# EAGLE design LPC1115_4TE_TOP (EAGLE 9.6.2)
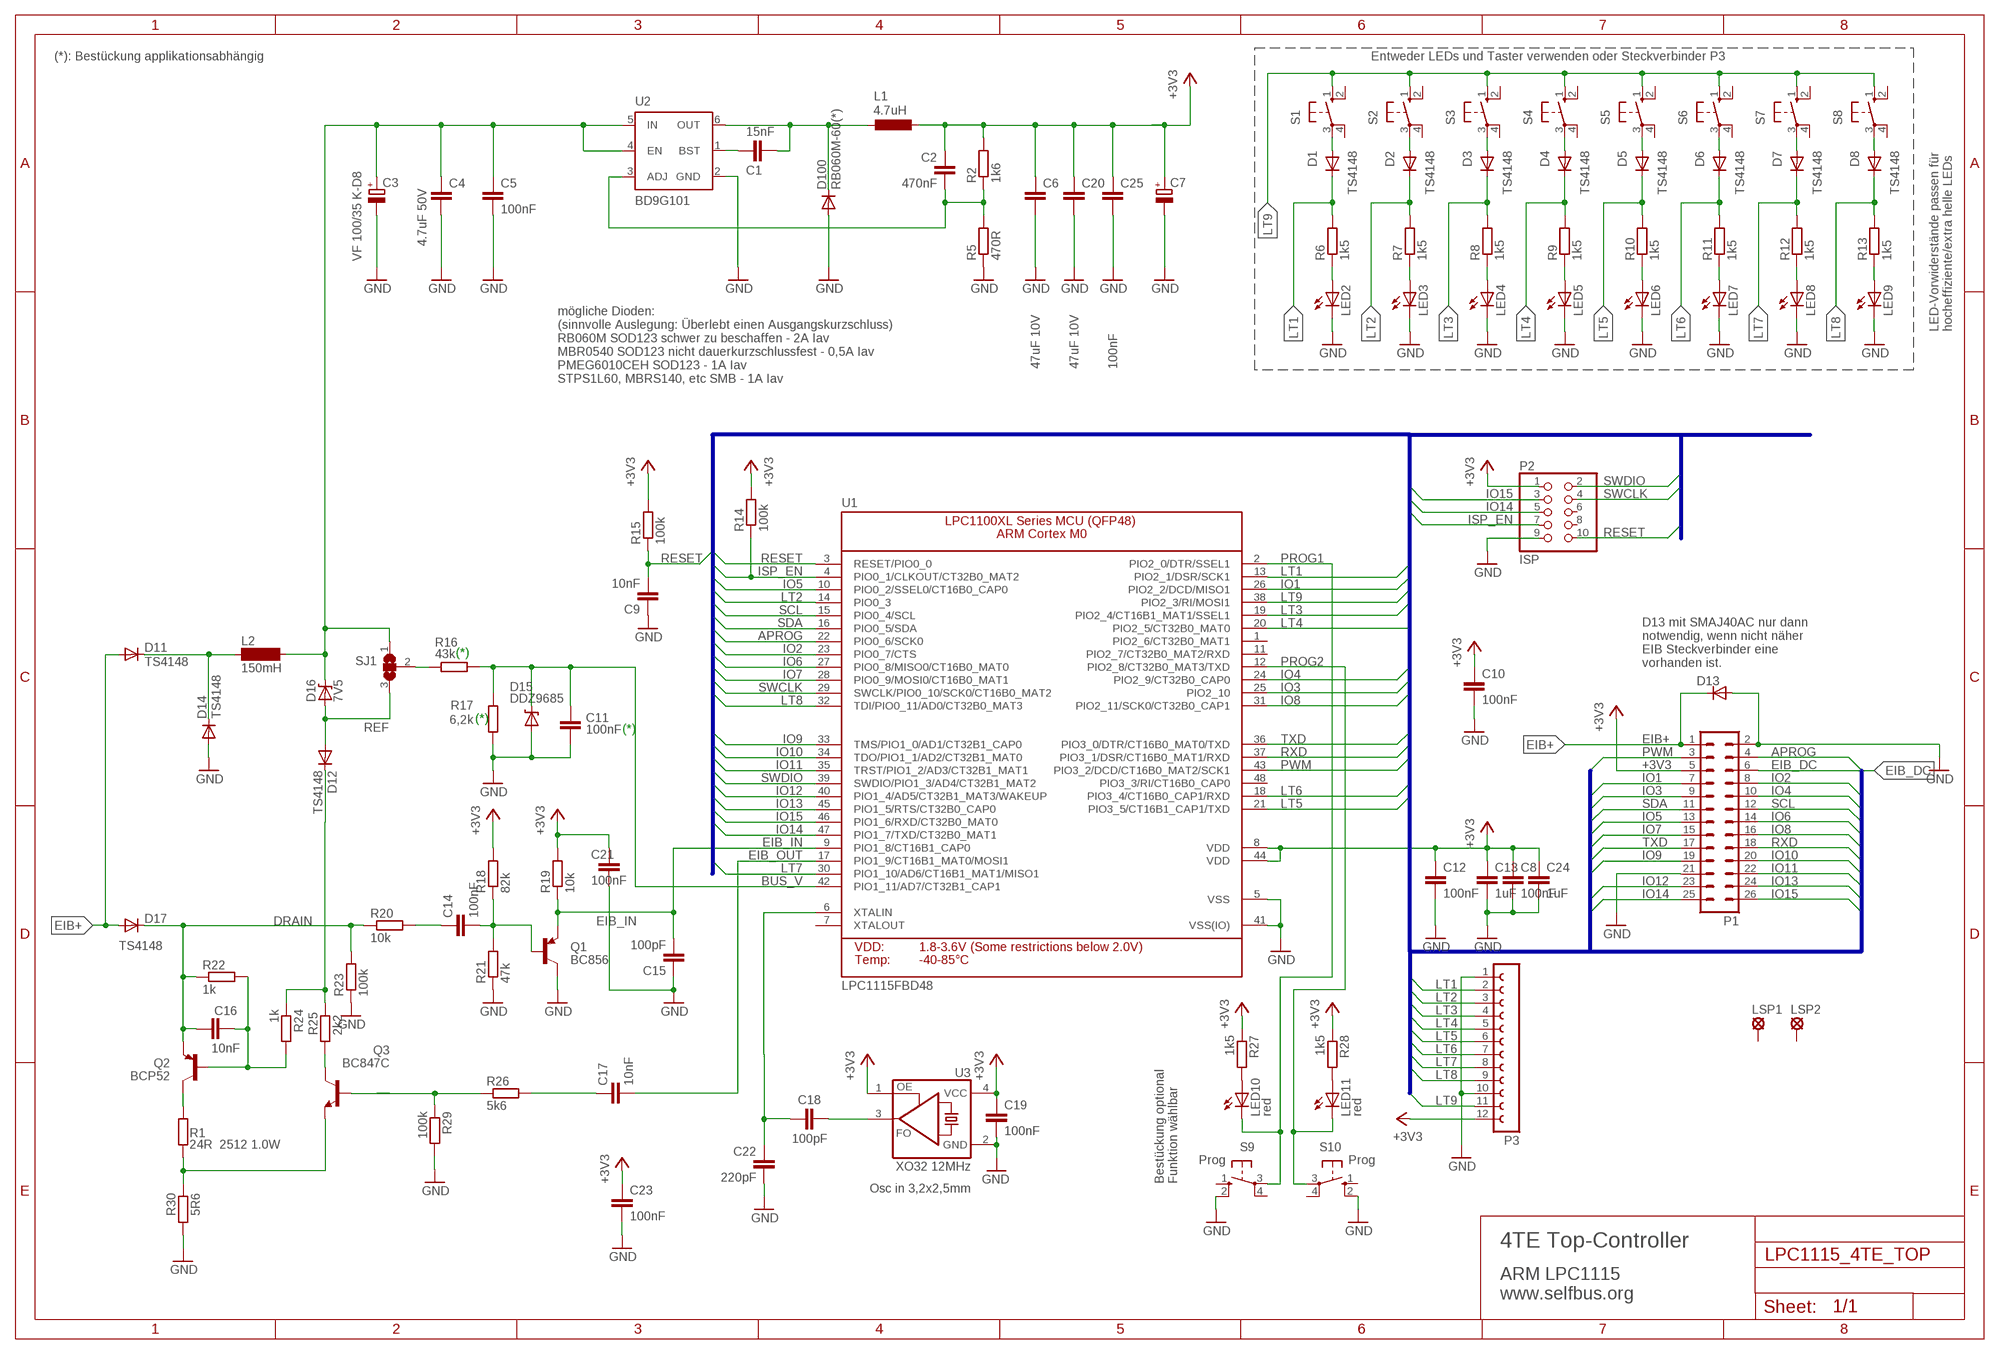
[diagram p0: schematic, sheet 1]

## Parts
C1  15nF  C-EUC0805  [C0805]
C2  470nF  C-EUC0805  [C0805]
C3  VF 100/35 K-D8  CPOL-EUESMD-D  [ESMD-D]
C4  4.7uF 50V  C-EUC0805  [C0805]
C5  100nF  C-EUC0805  [C0805]
C6  47uF 10V  C-EUC0805  [C0805]
C7  100uF  CPOL-EUESMD-D  [ESMD-D]
C8  100nF  C-EUC0805  [C0805]
C9  10nF  C-EUC0805  [C0805]
C10  100nF  C-EUC0805  [C0805]
C11  100nF  C-EUC0805  [C0805]
C12  100nF  C-EUC0805  [C0805]
C13  1uF  C-EUC0805  [C0805]
C14  100nF  C-EUC0805  [C0805]
C15  100pF  C-EUC0805  [C0805]
C16  10nF  C-EUC0805  [C0805]
C17  10nF  C-EUC0805  [C0805]
C18  100pF  C-EUC0805  [C0805]
C19  100nF  C-EUC0805  [C0805]
C20  47uF 10V  C-EUC0805  [C0805]
C21  100nF  C-EUC0805  [C0805]
C22  220pF  C-EUC0805  [C0805]
C23  100nF  C-EUC0805  [C0805]
C24  1uF  C-EUC0805  [C0805]
C25  100nF  C-EUC1206  [C1206]
D1  TS4148  DIODE-D0805  [D0805]
D2  TS4148  DIODE-D0805  [D0805]
D3  TS4148  DIODE-D0805  [D0805]
D4  TS4148  DIODE-D0805  [D0805]
D5  TS4148  DIODE-D0805  [D0805]
D6  TS4148  DIODE-D0805  [D0805]
D7  TS4148  DIODE-D0805  [D0805]
D8  TS4148  DIODE-D0805  [D0805]
D11  TS4148  DIODE-D0805  [D0805]
D12  TS4148  DIODE-D0805  [D0805]
D13  SMAJ40AC  D-SMB  [SMB]
D14  TS4148  DIODE-D0805  [D0805]
D15  DDZ9685  DIODE-ZENERSOD-123  [SOD-123]
D16  7V5  DIODE-ZENERSOD-123  [SOD-123]
D17  TS4148  DIODE-D0805  [D0805]
D100  RB060M-60(*)  DIODE-SOD123  [SOD123]
L1  4.7uH  L-EUL4532P  [L4532P]
L2  150mH  SD12BS11_LIEGEND  [BS11_LIEGEND]
LED2  LEDSMT1206  [1206]
LED3  LEDSMT1206  [1206]
LED4  LEDSMT1206  [1206]
LED5  LEDSMT1206  [1206]
LED6  LEDSMT1206  [1206]
LED7  LEDSMT1206  [1206]
LED8  LEDSMT1206  [1206]
LED9  LEDSMT1206  [1206]
LED10  red  LEDSMT1206  [1206]
LED11  red  LEDSMT1206  [1206]
LSP1  SE13_SM  [SE13_SM]
LSP2  SE13_SM  [SE13_SM]
P1  ML26  [ML26]
P2  ISP  PINHD-2X05_2.00  [2X05M]
P3  FE12-1  [FE12]
Q1  BC856  BC856BSMD  [SOT23-BEC]
Q2  BCP52  FZT753SMD  [SOT223]
Q3  BC847C  BC847  [SOT23]
R1  24R 2512 1.0W  R-EU_R2512  [R2512]
R2  1k6  R-EU_R0805  [R0805]
R5  470R  R-EU_R0805  [R0805]
R6  1k5  R-EU_R0805  [R0805]
R7  1k5  R-EU_R0805  [R0805]
R8  1k5  R-EU_R0805  [R0805]
R9  1k5  R-EU_R0805  [R0805]
R10  1k5  R-EU_R0805  [R0805]
R11  1k5  R-EU_R0805  [R0805]
R12  1k5  R-EU_R0805  [R0805]
R13  1k5  R-EU_R0805  [R0805]
R14  100k  R-EU_R0805  [R0805]
R15  100k  R-EU_R0805  [R0805]
R16  43k  R-EU_R0805  [R0805]
R17  6,2k  R-EU_R0805  [R0805]
R18  82k  R-EU_R0805  [R0805]
R19  10k  R-EU_R0805  [R0805]
R20  10k  R-EU_R0805  [R0805]
R21  47k  R-EU_R0805  [R0805]
R22  1k  R-EU_R0805  [R0805]
R23  100k  R-EU_R0805  [R0805]
R24  1k  R-EU_R0805  [R0805]
R25  2k2  R-EU_R0805  [R0805]
R26  5k6  R-EU_R0805  [R0805]
R27  1k5  R-EU_R0805  [R0805]
R28  1k5  R-EU_R0805  [R0805]
R29  100k  R-EU_R0805  [R0805]
R30  5R6  R-EU_R0805  [R0805]
S1  10-XXSMD  [B3F-10XX_SMD]
S2  10-XXSMD  [B3F-10XX_SMD]
S3  10-XXSMD  [B3F-10XX_SMD]
S4  10-XXSMD  [B3F-10XX_SMD]
S5  10-XXSMD  [B3F-10XX_SMD]
S6  10-XXSMD  [B3F-10XX_SMD]
S7  10-XXSMD  [B3F-10XX_SMD]
S8  10-XXSMD  [B3F-10XX_SMD]
S9  Prog  10-XXSMD  [B3F-10XX_SMD]
S10  Prog  10-XXSMD  [B3F-10XX_SMD]
SJ1  SJ2W  [SJ_2]
U1  LPC1115FBD48  LPC1113/4/5_QFP48_XLSERIES  [LQFP48]
U2  BD9G101  BD9G101GBD9G101G-SOT23-6MOD  [SOT23-6MOD]
U3  XO32 12MHz  ASFL  [ASF]

## Nets
+3V3: C2.1 C6.1 C7.+ C8.1 C10.1 C12.1 C13.1 C19.1 C20.1 C21.2 C23.1 C24.1 C25.1 L1.2 P1.5 P2.1 P3.12 R2.2 R14.2 R15.2 R18.2 R19.2 R27.1 R28.1 U1.8(VDD) U1.44(VDD) U3.1(OE) U3.4(VCC)
APROG: P1.4 U1.22(PIO0_6/SCK0)
BUS_V: C11.1 D15.C R16.2 R17.1 U1.42(PIO1_11/AD7/CT32B1_CAP1)
DRAIN: C16.1 D17.C Q2.3(E) R20.1 R22.1 R23.2
EIB+: D11.A D13.1(C) D17.A P1.1
EIB_DC: C3.+ C4.1 C5.1 D16.C L2.2 P1.6 SJ1.1 U2.4(EN) U2.5(IN)
EIB_IN: C15.2 Q1.E R19.1 U1.9(PIO1_8/CT16B1_CAP0)
EIB_OUT: C17.2 U1.17(PIO1_9/CT16B1_MAT0/MOSI1)
GND: C3.- C4.2 C5.2 C6.2 C7.- C8.2 C9.1 C10.2 C11.2 C12.2 C13.2 C15.1 C19.2 C20.2 C21.1 C22.2 C23.2 C24.2 C25.2 D13.2(A) D14.A D15.A D100.A LED2.C LED3.C LED4.C LED5.C LED6.C LED7.C LED8.C LED9.C P1.2 P1.21 P2.9 P3.1 P3.10 Q1.C R5.1 R17.2 R21.1 R23.1 R29.2 R30.1 S9.2(S1) S10.2(S1) U1.5(VSS) U1.41(VSS(IO)) U2.2(GND) U3.2(GND)
IO1: P1.7 U1.26(PIO2_2/DCD/MISO1)
IO2: P1.8 U1.23(PIO0_7/CTS)
IO3: P1.9 U1.25(PIO2_10)
IO4: P1.10 U1.24(PIO2_9/CT32B0_CAP0)
IO5: P1.13 U1.10(PIO0_2/SSEL0/CT16B0_CAP0)
IO6: P1.14 U1.27(PIO0_8/MISO0/CT16B0_MAT0)
IO7: P1.15 U1.28(PIO0_9/MOSI0/CT16B0_MAT1)
IO8: P1.16 U1.31(PIO2_11/SCK0/CT32B0_CAP1)
IO9: P1.19 U1.33(TMS/PIO1_0/AD1/CT32B1_CAP0)
IO10: P1.20 U1.34(TDO/PIO1_1/AD2/CT32B1_MAT0)
IO11: P1.22 U1.35(TRST/PIO1_2/AD3/CT32B1_MAT1)
IO12: P1.23 U1.40(PIO1_4/AD5/CT32B1_MAT3/WAKEUP)
IO13: P1.24 U1.45(PIO1_5/RTS/CT32B0_CAP0)
IO14: P1.25 P2.5 U1.47(PIO1_7/TXD/CT32B0_MAT1)
IO15: P1.26 P2.3 U1.46(PIO1_6/RXD/CT32B0_MAT0)
ISP_EN: P2.7 R14.1 U1.4(PIO0_1/CLKOUT/CT32B0_MAT2)
LT1: D1.C P3.2 R6.2 U1.13(PIO2_1/DSR/SCK1)
LT2: D2.C P3.3 R7.2 U1.14(PIO0_3)
LT3: D3.C P3.4 R8.2 U1.19(PIO2_4/CT16B1_MAT1/SSEL1)
LT4: D4.C P3.5 R9.2 U1.20(PIO2_5/CT32B0_MAT0)
LT5: D5.C P3.6 R10.2 U1.21(PIO3_5/CT16B1_CAP1/TXD)
LT6: D6.C P3.7 R11.2 U1.18(PIO3_4/CT16B0_CAP1/RXD)
LT7: D7.C P3.8 R12.2 U1.30(PIO1_10/AD6/CT16B1_MAT1/MISO1)
LT8: D8.C P3.9 R13.2 U1.32(TDI/PIO0_11/AD0/CT32B0_MAT3)
LT9: P3.11 S1.1(S) S2.1(S) S3.1(S) S4.1(S) S5.1(S) S6.1(S) S7.1(S) S8.1(S) U1.38(PIO2_3/RI/MOSI1)
LX: C1.1 D100.C L1.1 U2.6(OUT)
N$1: C17.1 R26.2
N$3: C14.1 R20.2
N$4: LED11.A R28.2
N$5: R16.1 SJ1.2
N$6: Q3.3(C) R25.1
N$7: Q3.2(E) R1.1 R30.2
N$8: D11.C D14.C L2.1
N$10: Q2.2(C) Q2.4(C) R1.2
N$12: Q3.1(B) R26.1 R29.1
N$14: C14.2 Q1.B R18.1 R21.2
N$15: C16.2 Q2.1(B) R22.2 R24.2
N$16: C18.1 U3.3(FO)
N$17: D8.A S8.3(P)
N$19: C1.2 U2.1(BST)
N$23: D7.A S7.3(P)
N$24: C2.2 R2.1 R5.2 U2.3(ADJ)
N$25: LED2.A R6.1
N$28: D6.A S6.3(P)
N$29: D5.A S5.3(P)
N$30: D4.A S4.3(P)
N$31: D3.A S3.3(P)
N$32: D2.A S2.3(P)
N$33: LED3.A R7.1
N$34: D1.A S1.3(P)
N$35: LED10.A R27.2
N$48: LED4.A R8.1
N$50: LED5.A R9.1
N$51: LED6.A R10.1
N$53: LED7.A R11.1
N$55: LED8.A R12.1
N$57: LED9.A R13.1
N$70: D12.C R24.1 R25.2
PROG1: LED10.C S9.3(P) U1.2(PIO2_0/DTR/SSEL1)
PROG2: LED11.C S10.3(P) U1.12(PIO2_8/CT32B0_MAT3/TXD)
PWM: P1.3 U1.43(PIO3_2/DCD/CT16B0_MAT2/SCK1)
REF: D12.A D16.A SJ1.3
RESET: C9.2 P2.10 R15.1 U1.3(RESET/PIO0_0)
RXD: P1.18 U1.37(PIO3_1/DSR/CT16B0_MAT1/RXD)
SCL: P1.12 U1.15(PIO0_4/SCL)
SDA: P1.11 U1.16(PIO0_5/SDA)
SWCLK: P2.4 U1.29(SWCLK/PIO0_10/SCK0/CT16B0_MAT2)
SWDIO: P2.2 U1.39(SWDIO/PIO1_3/AD4/CT32B1_MAT2)
TXD: P1.17 U1.36(PIO3_0/DTR/CT16B0_MAT0/TXD)
XTALIN: C18.2 C22.1 U1.6(XTALIN)
Unconnected: LSP1.MP LSP2.MP P2.6 P2.8 S1.2(S1) S1.4(P1) S2.2(S1) S2.4(P1) S3.2(S1) S3.4(P1) S4.2(S1) S4.4(P1) S5.2(S1) S5.4(P1) S6.2(S1) S6.4(P1) S7.2(S1) S7.4(P1) S8.2(S1) S8.4(P1) S9.1(S) S9.4(P1) S10.1(S) S10.4(P1) U1.1(PIO2_6/CT32B0_MAT1) U1.7(XTALOUT) U1.11(PIO2_7/CT32B0_MAT2/RXD) U1.48(PIO3_3/RI/CT16B0_CAP0)

## Buses
APROG,IO[1..15],ISP_EN,LT[1..9],PWM,RESET,RXD,SCL,SDA,SWCLK,SWDIO,TXD

## Notes on the sheet
- (*): Bestückung applikationsabhängig | Entweder LEDs und Taster verwenden oder Steckverbinder P3
- LED-Vorwiderstände passen für 
  hocheffiziente/extra helle LEDs
- mögliche Dioden:
  (sinnvolle Auslegung: Überlebt einen Ausgangskurzschluss)
  RB060M SOD123 schwer zu beschaffen - 2A Iav
  MBR0540 SOD123 nicht dauerkurzschlussfest - 0,5A Iav
  PMEG6010CEH SOD123 - 1A Iav
  STPS1L60, MBRS140, etc SMB - 1A Iav
- (*)
- D13 mit SMAJ40AC nur dann
  notwendig, wenn nicht näher
  EIB Steckverbinder eine
  vorhanden ist.
- (*)
- (*)
- Osc in 3,2x2,5mm
- Bestückung optional
  Funktion wählbar
- 4TE Top-Controller
- ARM LPC1115
  www.selfbus.org

## Library data of the parts
C1 C2 C4-C6 C8-C25 = rcl:C-EU: CAPACITOR, European symbol; SPICEPREFIX: C
C3 C7 = rcl:CPOL-EU: POLARIZED CAPACITOR, European symbol
D1-D8 D11 D12 D14 D17 D100 = diode:DIODE-: DIODE
D13 = semicon-smd-ipc:D-: DIODE unfilled
D15 D16 = Diode_for_Selfbus-Projects:DIODE-ZENER: Zener Diode SMA: 30V 1W Zener Diode, 1.2Vf - Digikey: SMAZ30-FDICT-ND
L1 = rcl:L-EU: INDUCTOR, European symbol; SPICEPREFIX: L
L2 = inductor-neosid:SD12: INDUCTOR nominal inductance
LED2-LED11 = led:LED: LED OSRAM: - CHIPLED LG R971, LG N971, LY N971, LG Q971, LY Q971, LO R971, LY R971 LH N974, LH R974 LS Q976, LO Q976, LY Q976 LO Q996 - Hyper CHIPLED LW Q18S LB Q993, LB Q99A, LB R99A - SideLED LS A670, LO A670, LY A670, LG A670, LP A670 LB A673, LV A673, LT A673, LW A673 LH A674 LY A675 LS A676, LA A676, LO A676, LY A676, LW A676 LS A679, LY A679, LG A679 - Hyper Micro SIDELED® LS Y876, LA Y876, LO Y876, LY Y876 LT Y87S - SmartLED LW L88C, LW L88S LB L89C, LB L89S, LG L890 LS L89K, LO L89K, LY L89K LS L896, LA L896, LO L896, LY L896 - TOPLED LS T670, LO T670, LY T670, LG T670, LP T670 LSG T670, LSP T670, LSY T670, LOP T670, LYG T670 LG T671, LOG T671, LSG T671 LB T673, LV T673, LT T673, LW T673 LH T674 LS T676, LA T676, LO T676, LY T676, LB T676, LH T676, LSB T676, LW T676 LB T67C, LV T67C, LT T67C, LS T67K, LO T67K, LY T67K, LW E67C LS E67B, LA E67B, LO E67B, LY E67B, LB E67C, LV E67C, LT E67C LW T67C LS T679, LY T679, LG T679 LS T770, LO T770, LY T770, LG T770, LP T770 LB T773, LV T773, LT T773, LW T773 LH T774 LS E675, LA E675, LY E675, LS T675 LS T776, LA T776, LO T776, LY T776, LB T776 LHGB T686 LT T68C, LB T68C - Hyper Mini TOPLED® LB M676 - Mini TOPLED Santana® LG M470 LS M47K, LO M47K, LY M47K Source: http://www.osram.convergy.de - LUMILED® LXK2-PW12-R00, LXK2-PW12-S00, LXK2-PW14-U00, LXK2-PW14-V00 LXK2-PM12-R00, LXK2-PM12-S00, LXK2-PM14-U00 LXK2-PE12-Q00, LXK2-PE12-R00, LXK2-PE12-S00, LXK2-PE14-T00, LXK2-PE14-U00 LXK2-PB12-K00, LXK2-PB12-L00, LXK2-PB12-M00, LXK2-PB14-N00, LXK2-PB14-P00, LXK2-PB14-Q00 LXK2-PR12-L00, LXK2-PR12-M00, LXK2-PR14-Q00, LXK2-PR14-R00 LXK2-PD12-Q00, LXK2-PD12-R00, LXK2-PD12-S00 LXK2-PH12-R00, LXK2-PH12-S00 LXK2-PL12-P00, LXK2-PL12-Q00, LXK2-PL12-R00 Source: www.luxeon.com
LSP1 LSP2 = solpad:SE13: SOLDER PAD E1542, drill 1,3mm, distributor Buerklin, 07F815
P1 = con-harting-ml:ML26: HARTING; OC_FARNELL: unknown; OC_NEWARK: unknown
P2 = pinhead-2:PINHD-2X05: PIN HEADER
P3 = con-lsta:FE12-1: FEMALE HEADER; OC_FARNELL: unknown; OC_NEWARK: unknown
Q1 = transistor-pnp:BC856*: PNP Transistror
Q2 = transistor-pnp:FZT753SMD: PNP Transistor
Q3 = transistor:BC847: NPN TRANSISTOR
R1 R2 R5-R30 = rcl:R-EU_: RESISTOR, European symbol; SPICEPREFIX: R
S1-S10 = switch-omron:10-XX: OMRON SWITCH
SJ1 = jumper:SJ2W: SMD solder JUMPER
U1 = microbuilder:LPC1113/4/5_QFP48_XLSERIES: LPC1113/4/5 ARM Cortex M0 MCU (50MHz) - XL Series (FBD48/3x3) LPC1115FBD48/303: Max Frequency: 50MHz Flash: 64kB SRAM: 8kB ADC: 10-bit
U2 = Stefan_selfbus:BD9G101G
U3 = crystal:ASF*: CRYSTAL CLOCK OSCILLATORS 5.0 Vdc or 3.3 Vdc - LOW PROFILE ULTRA MINIATURE CERAMIC SURFACE MOUNT Source: http://www.abracon.com/Oscillators/asf1-L-L1.pdf

## Board
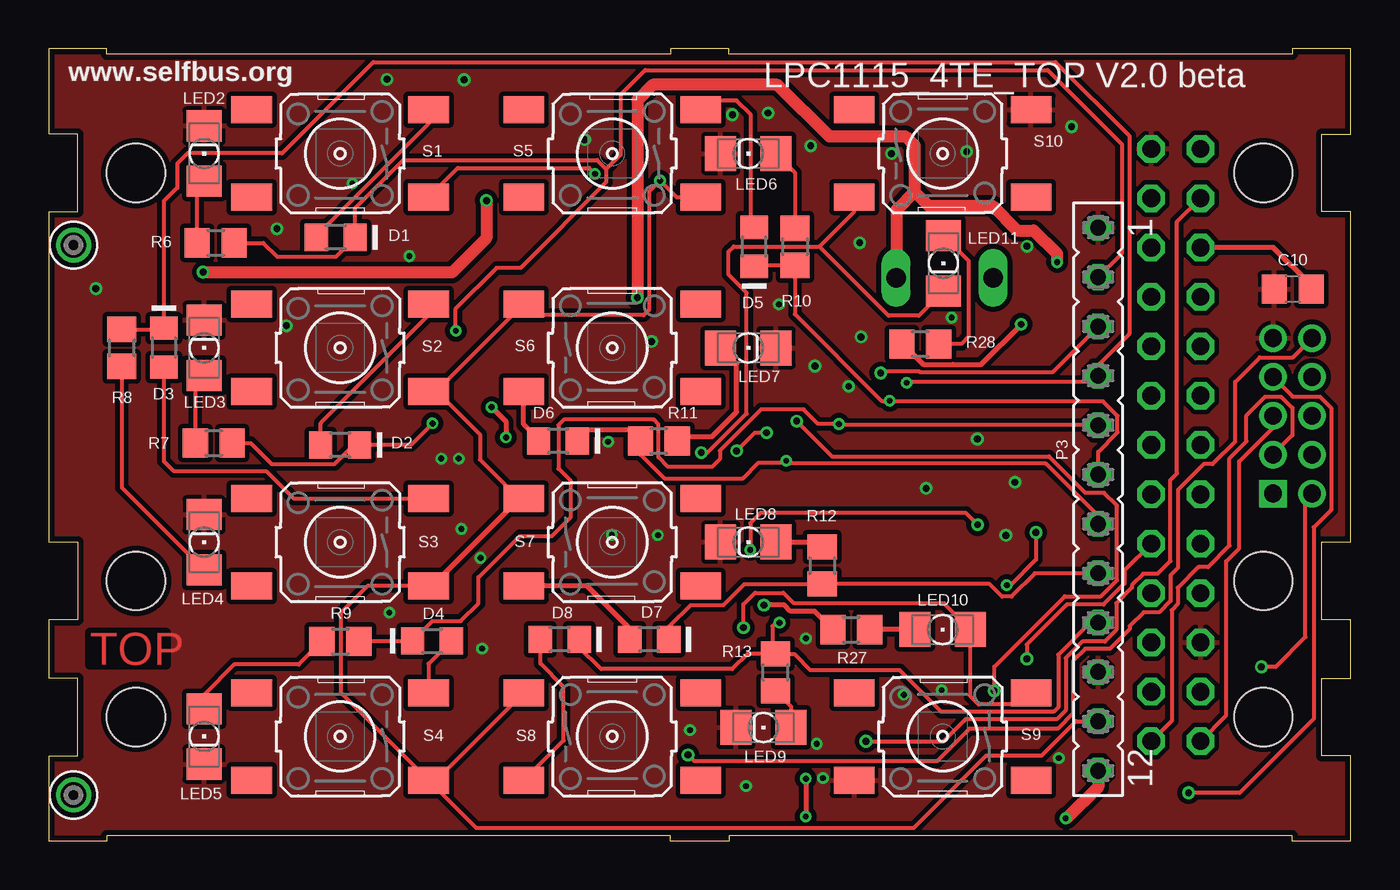
[diagram p1: board, top side]
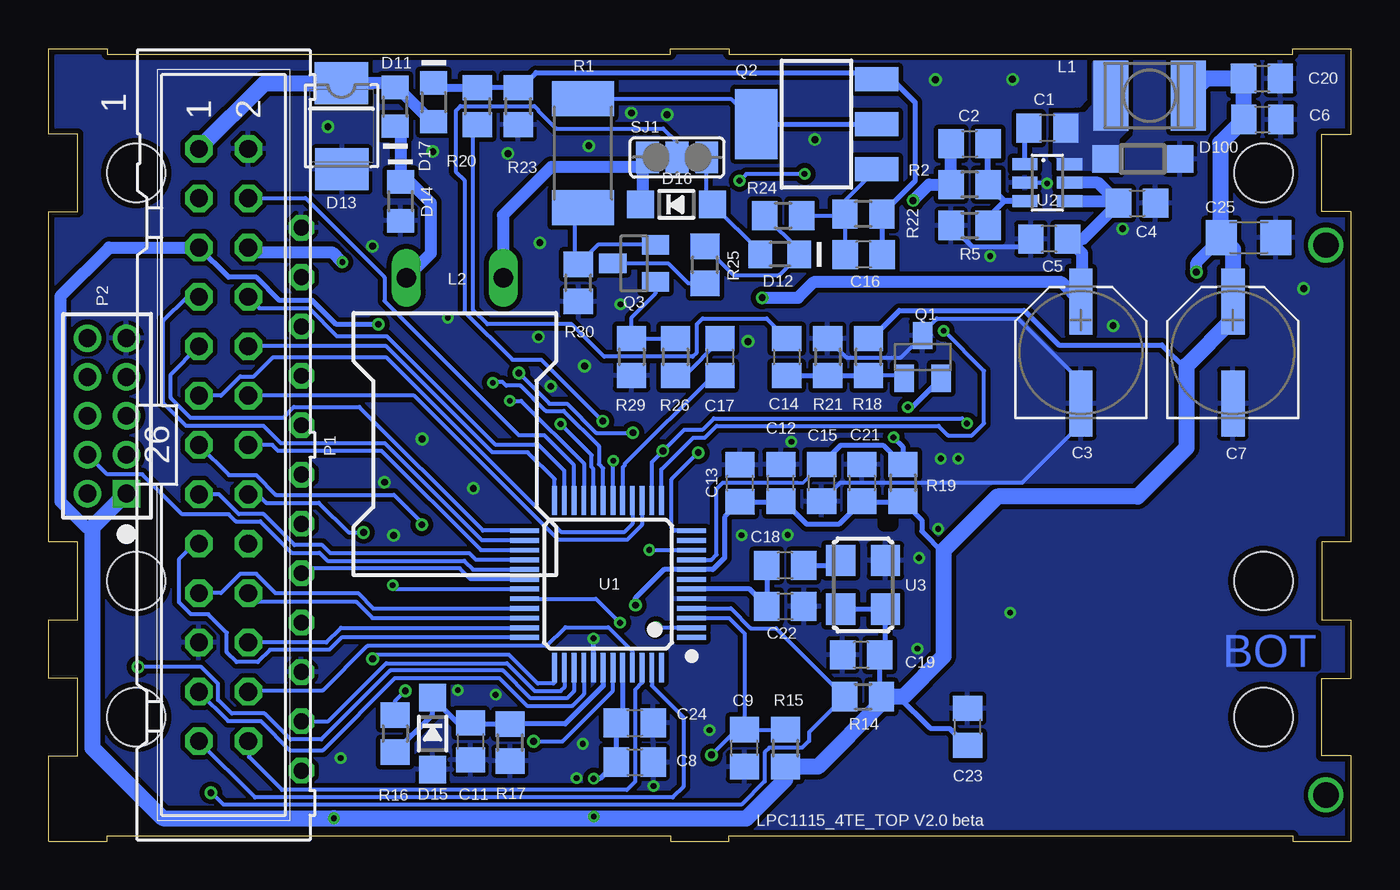
[diagram p2: board, bottom side, seen from below]

Size 67 x 40.8 mm. Coordinates in mm from the lower left corner, seen from the top.
Outline: 67,0 67,4.4 65.5,4.4 65.5,8.4 67,8.4 67,11.4 65.5,11.4 65.5,15.4 67,15.4 67,32.4 65.5,32.4 65.5,36.4 67,36.4 67,40.8 64,40.8 64,40.5 35,40.5 35,40.8 32,40.8 32,40.5 3,40.5 3,40.8 0,40.8 0,36.4 1.5,36.4 1.5,32.4 0,32.4 0,15.4 1.5,15.4 1.5,11.4 0,11.4 0,8.4 1.5,8.4 1.5,4.4 0,4.4 0,0 3,0 3,0.3 32,0.3 32,0 35,0 35,0.3 64,0.3 64,0 67,0
Copper layers (1*16): Top 0.035mm / dielectric 1.5mm / Bottom 0.035mm
Design rules "default *": minimum track width 0.18mm, minimum drill 0.3mm, track to track 0.18mm, track to pad 0.18mm, pad to pad 0.18mm, via to via 0.18mm, smd to smd 0.18mm, copper to edge 0.3mm, drill to drill 0.3mm, minimum pad ring 0.25mm, minimum via ring 0.15mm, stop-mask expansion 0.075mm, vias tented up to drill 12mil, thermal gap 0.2mm
Holes 3 mm at 62.5,6.4 4.5,6.4 4.5,34.4 62.5,34.4 4.5,13.4 62.5,13.4
bRestrict: area 23.6,16.3 to 24,16.5

### Footprints (pad centres in the part's own frame; a part is rotated, then mirrored left to right if it is on the bottom)
C0805 = smd 1.3 x 1.5: 1 -0.95,0; 2 0.95,0
ESMD-D = smd 1.2 x 3.4: + 0,2.623; - 0,-2.623
C1206 = smd 1.6 x 1.8: 1 -1.4,0; 2 1.4,0
D0805 = smd 1.2 x 1.4: A 1,0; C -1,0
SMB = smd 2.159 x 2.743: 1 -2.311,-0.127; 2 2.108,-0.102
SOD-123 = smd 1.4 x 1.4: A 1.85,0; C -1.85,0
SOD123 = smd 1.4 x 1.4: A 1.9,0; C -1.9,0
L4532P = smd 1.8 x 3.6: 1 -2,0; 2 2,0
BS11_LIEGEND = drill 1 long: 1 -2.5,0; 2 2.5,0
1206 = smd 1.6 x 1.803: A -1.422,0; C 1.422,0
SE13_SM = drill 1.3: MP 0,0
ML26 = drill 0.914 octagon: 1 -15.24,-1.27; 2 -15.24,1.27; 3 -12.7,-1.27; 4 -12.7,1.27; 5 -10.16,-1.27; 6 -10.16,1.27; 7 -7.62,-1.27; 8 -7.62,1.27; 9 -5.08,-1.27; 10 -5.08,1.27; 11 -2.54,-1.27; 12 -2.54,1.27; 13 0,-1.27; 14 0,1.27; 15 2.54,-1.27; 16 2.54,1.27; 17 5.08,-1.27; 18 5.08,1.27; 19 7.62,-1.27; 20 7.62,1.27; 21 10.16,-1.27; 22 10.16,1.27; 23 12.7,-1.27; 24 12.7,1.27; 25 15.24,-1.27; 26 15.24,1.27
2X05M = drill 0.914 square: 1 -4,-1 | drill 0.914: 2 -4,1; 3 -2,-1; 4 -2,1; 5 0,-1; 6 0,1; 7 2,-1; 8 2,1; 9 4,-1; 10 4,1
FE12 = drill 0.813 octagon: 1 -13.97,0; 2 -11.43,0; 3 -8.89,0; 4 -6.35,0; 5 -3.81,0; 6 -1.27,0; 7 1.27,0; 8 3.81,0; 9 6.35,0; 10 8.89,0; 11 11.43,0; 12 13.97,0
SOT23-BEC = smd 1 x 1.4: B -0.95,-1.1; C 0,1.1; E 0.95,-1.1
SOT223 = smd 1.219 x 2.235: 1 -2.311,-3.099; 2 0,-3.099; 3 2.311,-3.099 | smd 3.6 x 2.2: 4 0,3.099
SOT23 = smd 1 x 1.4: 1 -0.95,-1.1; 2 0.95,-1.1; 3 0,1.1
R2512 = smd 1.8 x 3.2: 1 -2.8,0; 2 2.8,0
R0805 = smd 1.3 x 1.5: 1 -0.95,0; 2 0.95,0
B3F-10XX_SMD = smd 2.1 x 1.4: 1 -4.55,2.25; 2 4.55,2.25; 3 -4.55,-2.25; 4 4.55,-2.25
SJ_2 = smd 1.168 x 1.6: 1 -1.524,0; 2 0,0; 3 1.524,0
LQFP48 = smd 1.5 x 0.25: 1 -4.3,2.75; 2 -4.3,2.25; 3 -4.3,1.75; 4 -4.3,1.25; 5 -4.3,0.75; 6 -4.3,0.25; 7 -4.3,-0.25; 8 -4.3,-0.75; 9 -4.3,-1.25; 10 -4.3,-1.75; 11 -4.3,-2.25; 12 -4.3,-2.75; 25 4.3,-2.75; 26 4.3,-2.25; 27 4.3,-1.75; 28 4.3,-1.25; 29 4.3,-0.75; 30 4.3,-0.25; 31 4.3,0.25; 32 4.3,0.75; 33 4.3,1.25; 34 4.3,1.75; 35 4.3,2.25; 36 4.3,2.75 | smd 0.25 x 1.5: 13 -2.75,-4.3; 14 -2.25,-4.3; 15 -1.75,-4.3; 16 -1.25,-4.3; 17 -0.75,-4.3; 18 -0.25,-4.3; 19 0.25,-4.3; 20 0.75,-4.3; 21 1.25,-4.3; 22 1.75,-4.3; 23 2.25,-4.3; 24 2.75,-4.3; 37 2.75,4.3; 38 2.25,4.3; 39 1.75,4.3; 40 1.25,4.3; 41 0.75,4.3; 42 0.25,4.3; 43 -0.25,4.3; 44 -0.75,4.3; 45 -1.25,4.3; 46 -1.75,4.3; 47 -2.25,4.3; 48 -2.75,4.3
SOT23-6MOD = smd 0.6 x 1.3: 1 -0.95,-1.15; 2 0,-1.15; 3 0.95,-1.15; 4 0.95,1.15; 5 0,1.15; 6 -0.95,1.15
ASF = smd 1.6 x 1.5: 1 -1.25,-1.15; 2 1.25,-1.15; 3 1.25,1.15; 4 -1.25,1.15

### Placement (x,y rotation side)
C1  15.62,36.7 180 bottom
C2  19.62,35.9 0 bottom
C3  13.89,25.16 0 bottom
C4  11,32.84 0 bottom
C5  15.52,31 180 bottom
C6  4.56,37.15 0 bottom
C7  6.07,25.16 0 bottom
C8  36.84,4.08 0 bottom
C9  31.2,4.8 90 bottom
C10  64.01,28.42 180 top
C11  45.3,5.15 270 bottom
C12  29.33,18.45 90 bottom
C13  31.43,18.43 90 bottom
C14  29.03,24.93 270 bottom
C15  27.23,18.45 90 bottom
C16  25.06,30.2 180 bottom
C17  32.46,24.93 270 bottom
C18  29.1,14.2 180 bottom
C19  25.2,9.6 180 bottom
C20  4.58,39.26 0 bottom
C21  25.15,18.45 270 bottom
C22  29.1,12.1 0 bottom
C23  19.72,5.9 90 bottom
C24  36.85,6.1 0 bottom
C25  5.26,31.07 0 bottom
D1  14.77,31.08 180 top
D2  15,20.4 180 top
D3  5.93,25.42 270 top
D4  19.73,10.32 0 top
D5  36.3,30.6 90 top
D6  26.21,20.61 180 top
D7  30.9,10.4 180 top
D8  26.3,10.4 180 top
D11  49.17,37.81 90 bottom
D12  29.38,30.21 180 bottom
D13  51.81,36.7 270 bottom
D14  48.9,32.94 270 bottom
D15  47.25,5.55 270 bottom
D16  34.7,32.78 0 bottom
D17  47.19,38.04 270 bottom
D100  10.7,35.12 0 bottom
L1  10.36,38.37 0 bottom
L2  46.1,29 0 bottom
LED2  8,35.4 90 top
LED3  8,25.4 90 top
LED4  8,15.4 90 top
LED5  8,5.4 270 top
LED6  36,35.4 180 top
LED7  36,25.4 0 top
LED8  36,15.4 180 top
LED9  36.78,5.86 180 top
LED10  46,10.9 0 top
LED11  46.04,29.75 270 top
LSP1  1.28,30.69 0 top
LSP2  1.28,2.39 0 top
P1  58,20.4 270 bottom
P2  64,21.9 90 bottom
P3  54,17.61 270 top
Q1  22.04,24.93 0 bottom
Q2  27.5,36.91 90 bottom
Q3  36.88,29.75 90 bottom
R1  39.51,35.41 90 bottom
R2  19.62,33.8 180 bottom
R5  19.62,31.7 0 bottom
R6  8.6,30.8 0 top
R7  8.5,20.5 0 top
R8  3.77,25.4 90 top
R9  15.01,10.29 0 top
R10  38.4,30.6 270 top
R11  31.4,20.6 180 top
R12  39.8,14.2 270 top
R13  37.4,8.7 90 top
R14  25.1,7.45 0 bottom
R15  29.1,4.8 270 bottom
R16  49.17,5.55 270 bottom
R17  43.27,5.09 270 bottom
R18  24.82,24.93 90 bottom
R19  23.05,18.45 270 bottom
R20  44.95,37.83 270 bottom
R21  26.92,24.93 270 bottom
R22  25.08,32.28 180 bottom
R23  42.84,37.83 90 bottom
R24  29.21,32.2 0 bottom
R25  33.23,29.67 90 bottom
R26  34.75,24.93 270 bottom
R27  41.3,10.9 0 top
R28  44.85,25.6 0 top
R29  37.01,24.93 270 bottom
R30  39.75,28.74 90 bottom
S1  15,35.4 180 top
S2  15,25.4 180 top
S3  15,15.4 180 top
S4  15,5.4 180 top
S5  29,35.4 180 top
S6  29,25.4 0 top
S7  29,15.4 0 top
S8  29,5.4 0 top
S9  46,5.4 180 top
S10  46,35.4 0 top
SJ1  34.67,35.2 0 bottom
U1  38.22,13.24 180 bottom
U2  15.62,33.9 270 bottom
U3  25.1,13.2 90 bottom

### Tracks (layer width: path | path; a pad name or v marks a point on that pad's centre or on a via)
+3V3  (via drill 0.3, 0.35)
  Top 0.254: R28.1 43.97,25.6 45.02,24.54 46.51,24.54 47.97,24.54 v50.04,26.61 | R27.1 39.41,11.84 38.18,11.84 37.87,12.16 v36.81,12.16 | C10.1 64.96,28.62 63.02,30.56 P1.5 | v38.96,3.23 v38.96,1.29 v38.95,1.28
  Top 0.61: v22.53,32.98 22.53,31.05 20.76,29.28 7.97,29.28 v7.95,29.3 | P3.12 54,2.79 52.4,1.19 v52.33,1.19
  Bottom 0.254: U3.4 U3.1 23.95,9.9 C19.1 24.25,7.55 R14.2 | v50.04,26.61 52.21,26.61 53.44,27.84 55.12,27.84 56.31,29.03 57.74,29.03 P1.5 | R18.2 24.68,25.88 23.24,27.32 16.8,27.32 15.03,25.55 9.72,25.55 8.45,24.28 | v38.96,3.23 38.64,3.23 C8.1 C24.1 37.47,6.43 37.47,8.83 U1.44 | v36.81,12.16 36.81,12.53 35.35,13.99 U1.8 32.82,13.99 32.22,14.59 32.22,16.68 C13.1 29.36,17.47 C12.1 29.17,17.5 27.99,16.31 26.35,16.31 25.17,17.5 C21.2 25.12,17.47 23.08,17.47 R19.2 22.08,16.53 22.08,15.95 20.95,14.83 | v38.95,1.28 38.85,1.18 38.15,1.18 | C23.1 19.79,4.95 20.65,5.81 21.63,5.81 23.27,7.45
  Bottom 0.61: C2.1 R2.2 21.71,33.8 v22.53,32.98 | P1.5 63.89,30.56 66.39,28.05 66.39,17.49 65.01,16.11 64.79,16.11 | v7.95,29.3 7.95,29.78 C25.1
  Bottom 0.813: 64.75,16.15 64.75,4.82 61.13,1.19 v52.33,1.19 v52.32,1.18 38.15,1.18 31.1,1.18 29.1,3.18 R15.2 27.42,3.85 24.15,7.12 R14.2 23.27,7.45 23.03,7.45 20.95,9.53 20.95,14.83 20.95,14.94 20.95,14.99 18.19,17.75 10.97,17.75 8.45,20.27 8.45,24.28 8.45,24.5 6.07,26.88 C7.+ 6.07,30.48 C25.1 6.72,31.13 6.72,35.94 C6.1 5.53,37.17 C20.1 7.47,39.26 L1.2 | P2.1 64.75,16.15 | 64.75,16.15 64.79,16.11
APROG
  Bottom 0.2: U1.22 39.97,19.37 41.5,20.9 42.81,20.9 49.72,27.81 49.72,29.04 53.79,33.11 P1.4
BUS_V
  Bottom 0.254: R16.2 47.25,6.52 D15.C 45.95,6.1 C11.1 45.24,6.04 R17.1 40.42,6.04 38.47,7.99 U1.42
DRAIN
  Bottom 0.254: C16.1 24.13,30.22 R22.1 22.43,33.98 22.43,38.04 23.61,39.22 Q2.3 24.75,39.57 41.93,39.57 42.71,38.78 R23.2 R20.1
  Bottom 0.406: D17.C 46.93,38.78 R20.1
EIB+
  Bottom 0.61: D17.A 47.31,37.04 49.08,38.81 D11.A 49.54,38.81 49.74,39.01 D13.1
  Bottom 0.813: D13.1 55.9,39.01 P1.1
EIB_DC  (via drill 0.3, 0.35)
  Top 0.61: L2.2 43.63,29.04 43.63,32.52 44.55,33.43 | v30.29,27.98 30.29,38.15 31.08,38.94 37.51,38.94 40.16,36.28 44.08,36.28 44.55,35.81 44.55,33.43 | 44.55,33.43 45.27,32.71 48.55,32.71 49.83,31.44 50.67,31.44 51.89,30.22 v51.89,29.81
  Bottom 0.61: C4.1 13.01,33.9 U2.5 | U2.4 12.06,32.95 C4.1 | D16.C 36.45,32.88 36.45,34.94 SJ1.1 36.68,34.71 41.14,34.71 43.63,32.22 43.63,29.03 L2.2 | C4.1 13.79,31 C5.1 13.84,30.27 13.84,27.84 C3.+ 14.88,28.78 27.64,28.78 28.44,27.98 v30.29,27.98 | v51.89,29.81 51.92,29.81 52.43,30.32 56.49,30.32 P1.6
EIB_IN  (via drill 0.3)
  Top 0.254: v22.79,22.35 23.53,21.61 v23.53,20.79
  Bottom 0.18: C15.2 28.18,18.45 28.49,18.45
  Bottom 0.2: U1.9 32.91,14.49 32.63,14.76 32.63,18.14 32.33,18.45 28.49,18.45
  Bottom 0.254: C15.2 26.24,20.39 24.09,20.39 23.1,19.4 R19.1 23.06,20.32 v23.53,20.79 | Q1.E 22.57,22.35 v22.79,22.35
EIB_OUT
  Bottom 0.2: U1.17 37.47,19.25 37.37,19.35 37.37,19.41 32.8,23.98 C17.2
GND  (via drill 0.3, 0.35)
  Bottom 0.2: R21.1 25.95,24.91 23.16,24.91 Q1.C 22.04,26.18 21.31,26.91 17.13,26.91 13.89,23.67 C3.- 13.89,21.48 16.91,18.46 26.27,18.46 C15.1 | U2.2 15.67,33.9 v15.63,33.86
  Bottom 0.254: U1.41 v38.97,10.44 | R5.1 19.48,30.61 16.86,30.61 C5.2
  other vias: 21.1,19.7 20.2,19.7 28.98,15.77 31.35,15.76 2.43,28.45 11.75,31.53 21.38,39.2 17.41,39.22 27.58,36.12 35.18,37.4 41.73,30.81 47.23,35.5 39.21,35.8 41.8,25.96 46.46,26.96 39.43,24.46 37.02,37.49 41.17,23.42 31.02,25.73 45.15,18.17 47.79,20.71 49.72,18.48 49.25,15.75 39.52,5.02 22.3,9.92 22.22,14.59 51.98,4.29 12.24,26.54 33,5.73 35.88,2.85 28.79,20.57 21.24,16.08 39.84,3.26 50.34,30.63 43.37,35.4 45.95,7.79 44,7.55 17.53,11.77 18.56,30.12 37.58,27.64 52.64,36.78
  pour Bottom (isolate 0.25, rank 2): 67,40.5 0.1,40.5 0.1,0.3 67,0.3
  pour Top (isolate 0.25): 67.03,40.52 0.13,40.52 0.13,0.32 67.03,0.32
IO1
  Bottom 0.2: P1.7 59.88,28.02 61.1,26.8 61.1,22.55 59.94,21.39 55.95,21.39 55.04,20.48 52.71,20.48 49.7,20.48 44.7,15.49 U1.26
IO2
  Bottom 0.2: U1.23 40.47,19.07 41.8,20.4 44,20.4 49.6,26 52.18,26 53.61,27.44 56.15,27.44 P1.8
IO3
  Bottom 0.2: P1.9 60.72,24.03 60.72,22.82 59.7,21.8 54.94,21.8 54.39,22.36 51.02,22.36 44.65,15.99 U1.25
IO4
  Bottom 0.2: U1.24 40.97,18.64 42.35,20.02 44.17,20.02 49.63,25.48 P1.10
IO5  (via drill 0.3, 0.35)
  Top 0.2: v47.8,16.3 47.2,16.9 36.62,16.9 36.1,16.38 v36.1,15
  Bottom 0.2: P1.13 57.72,18.85 56.32,18.85 55.31,17.84 49.24,17.84 47.8,16.4 v47.8,16.3 | v36.1,15 v36.09,14.99 U1.10
IO6
  Bottom 0.2: P1.14 55.5,20.4 55.2,20.1 49.87,20.1 44.76,14.99 U1.27 | U1.27
IO7
  Bottom 0.2: P1.15 58.23,17.86 57.22,16.85 55.95,16.85 54.35,15.25 52.93,15.25 52.52,14.84 45.37,14.84 45.02,14.49 U1.28
IO8  (via drill 0.3, 0.35)
  Top 0.2: v50.8,15.9 50.8,14.5 49.48,13.19 v49.3,13.19
  Bottom 0.2: P1.16 56.24,17.86 55.81,17.43 53.11,17.43 51.58,15.9 v50.8,15.9 | v49.3,13.19 49.1,12.99 U1.31
IO9
  Bottom 0.2: P1.19 58.13,12.78 57.14,13.77 56.32,13.77 55.34,12.79 51.09,12.79 50.3,11.99 U1.33
IO10
  Bottom 0.2: P1.20 56.27,12.31 51.16,12.31 50.34,11.49 U1.34
IO11
  Bottom 0.2: P1.22 52.72,10.24 51.97,10.99 U1.35
IO12
  Bottom 0.2: U1.40 39.47,7.57 40.06,6.98 42.4,6.98 43.83,8.41 49.17,8.41 52.88,4.7 54.59,4.7 56.09,6.2 57.77,6.2 P1.23
IO13
  Bottom 0.2: U1.45 36.97,9.79 38.2,11.02 40.42,11.02 41.39,10.05 50.62,10.05 52.88,7.78 56.65,7.78 P1.24
IO14
  Top 0.2: P1.25 60.59,6.48 60.59,14.41 61.26,15.08 61.26,19.56 63,21.3 P2.5
  Bottom 0.2: U1.47 35.97,8.01 34.35,6.39 34.35,2.82 34.9,2.27 56.38,2.27 P1.25
IO15
  Top 0.2: P1.26 57.78,6.21 57.78,11.9 58.1,12.21 58.1,13.06 59.16,14.12 59.66,14.12 60.76,15.22 60.76,19.71 61.63,20.59 61.63,21.93 62.59,22.89 63.41,22.89 63.99,22.31 63.99,20.91 63,19.92 P2.3
  Bottom 0.2: P1.26 56.69,5.12 56.69,4.35 54.99,2.65 37.25,2.65 36.83,3.07 36.83,7.81 36.47,8.17 U1.46
ISP_EN  (via drill 0.35)
  Top 0.2: v58.65,2.5 61.29,2.5 65.09,6.3 65.09,16.17 65.99,17.06 65.99,22.31 65.41,22.89 64.01,22.89 P2.7
  Bottom 0.2: U1.4 31.91,12 30.88,10.97 29.57,10.97 R14.1 27.88,5.62 27.88,5.17 28.23,4.82 29.93,4.82 30.17,4.58 30.17,3.08 31.36,1.89 58,1.89 58.61,2.5 v58.65,2.5
LT1  (via drill 0.3)
  Top 0.2: R6.2 11.05,30.8 11.78,30.07 14.76,30.07 D1.C 15.77,32.59 18.24,35.06 28.22,35.06 28.69,34.59 | v20.95,26.28 20.95,27.42 23.04,29.51 24.28,29.51 28.69,33.93 28.69,34.59 | 28.69,34.59 29.43,35.33 29.43,38.43 30.69,39.69 51.41,39.69 52.88,38.22 55.21,35.89 55.21,30.25 P3.2
  Bottom 0.2: U1.13 35.47,19.14 33.83,20.78 33.23,20.78 32.63,21.38 21.21,21.38 20.73,20.9 19.49,20.9 18.88,21.51 18.88,24.21 v20.95,26.28
LT2  (via drill 0.3, 0.35)
  Top 0.2: R7.2 10.4,20.5 11.48,19.42 14.72,19.42 15.7,20.4 D2.C 18.64,20.4 v19.75,21.51 | P3.3 51.64,24.14 44.85,24.14 44.81,24.18 42.89,24.18 v42.81,24.1 | v36.94,21.02 36.33,21.02 v35.4,20.09
  Bottom 0.2: v19.75,21.51 20.01,21.77 32.78,21.77 33.37,21.18 34.31,21.18 v35.39,20.09 v35.4,20.09 35.97,19.52 U1.14 | v42.81,24.1 41.24,22.53 40.34,22.53 38.84,21.02 v36.94,21.02
LT3  (via drill 0.3)
  Top 0.2: v44.15,23.6 44.19,23.64 53.68,23.64 P3.4 54,24.52 55.59,26.11 55.59,36.31 51.8,40.1 16.7,40.1 12.01,35.41 7.14,35.41 6.62,34.88 6.62,33.64 5.93,32.95 D3.C 5.86,26.35 R8.2
  Bottom 0.2: U1.19 38.47,19.2 38.69,19.41 38.69,20.34 40.5,22.15 41.42,22.15 42.73,23.45 43.45,23.45 43.65,23.65 44.1,23.65 v44.15,23.6
LT4  (via drill 0.3)
  Top 0.2: P3.5 40.73,21.42 v40.67,21.48 39.59,21.48 38.84,22.23 36.66,22.23 34.53,20.11 34.53,19.68 34.14,19.28 31.87,19.28 31.38,19.77 31.38,21.47 31.15,21.7 26.51,21.7 26.23,21.42 26.23,19.19 26.85,18.57 26.85,16.66 25.9,15.71 24.25,15.71 22.12,13.59 22.12,12.25 21.21,11.34 19.75,11.34 D4.C 18.7,10.29 R9.2
  Bottom 0.2: U1.20 38.97,19.16 39.07,19.25 39.07,19.88 v40.67,21.48
LT5  (via drill 0.3)
  Top 0.2: D5.C 36.35,29.65 R10.2 38.4,27.13 42.85,22.67 v43.27,22.67 43.3,22.65 54.25,22.65 55,21.9 55,21.05 54,20.05 P3.6
  Bottom 0.2: U1.21 39.47,19.45 42.69,22.67 v43.27,22.67
LT6  (via drill 0.3)
  Top 0.2: R11.2 30.45,19.91 31.68,18.68 35.72,18.68 36.53,19.49 37.85,19.49 v37.95,19.59 38.1,19.44 51.3,19.44 54,16.74 P3.7
  Top 0.254: R11.2 29.87,21.18 27.78,21.18 D6.C
  Bottom 0.2: U1.18 37.97,19.57 v37.95,19.59
LT7
  Top 0.2: D7.C 31.9,11.03 33.04,12.17 34.72,12.17 35.8,13.25 R12.2 48.41,13.25 49.06,12.61 49.54,12.61 50.73,13.8 P3.8
  Bottom 0.2: P3.8 53.73,14.05 45.85,14.05 45.29,13.49 U1.30
LT8  (via drill 0.3)
  Top 0.2: R13.2 38.37,9.65 39.21,8.81 43.79,8.81 45.93,6.67 51.72,6.67 51.95,6.9 51.95,9.6 53.61,11.26 P3.9 | R13.2 35.95,9.65 35.17,8.87 28.42,8.87 27.3,9.99 D8.C | v37.6,11.25 37.42,11.25 37.24,11.07 37.24,9.71 37.3,9.65 R13.2
  Bottom 0.2: U1.32 38.84,12.49 v37.6,11.25
LT9  (via drill 0.3)
  Top 0.2: 19.95,23.15 19.7,23.15 | 19.7,23.15 19.6,23.15 | 19.6,23.15 S2.1 | 19.95,23.15 S6.1 25.02,27.08 30.62,27.08 30.91,27.38 30.91,33.45 v31.46,34 32.31,33.15 S5.1 | 19.95,23.15 19.7,23.15 | S8.1 19.95,3.15 S4.1 19.6,3.1 | 19.6,3.1 22,0.7 44.52,0.7 48.23,4.41 51.09,4.41 52.86,6.18 P3.11 | S7.1 24.2,17.65 22.2,19.65 22.2,20.94 19.99,23.15 19.6,23.15 | S3.1 19.41,13.15 16.42,13.15 15.03,11.76 15.03,7.67 19.6,3.1 | S1.1 21.05,34.65 27.81,34.65 v28.11,34.35
  Top 0.254: S7.1 24.35,17.55 24.13,17.55 19.73,13.15 S3.1
  Bottom 0.2: U1.38 40.47,7.93 40.66,7.74 42,7.74 43.43,9.17 49.63,9.17 52.62,6.18 P3.11 | v28.11,34.35 31.11,34.35 v31.46,34
LX
  pour Bottom (isolate 0.254, no thermals): 15.28,37.44 15.28,35.98 15.3,35.96 15.3,35.35 15.12,35.17 15.12,34.59 15.1,34.57 13.38,34.57 13.27,34.46 12.01,34.46 11.93,34.54 11.93,36.16 11.5,36.59 11.5,40.13 11.53,40.16 13.17,40.16 13.29,40.04 13.29,37.88 13.7,37.47 13.97,37.47 13.99,37.45 15.27,37.45
N$1
  Bottom 0.2: C17.1 32.46,25.79 34.27,23.98 R26.2
N$3
  Bottom 0.2: R20.2 45.18,36.65 45.18,27.38 44.42,26.62 40.09,26.62 38.41,24.94 33.87,24.94 33.65,25.16 33.65,26.62 33.36,26.91 30.06,26.91 C14.1
N$4
  Top 0.2: LED11.A 47.33,29.88 47.33,25.97 46.96,25.6 R28.2
N$5  (via drill 0.35)
  Top 0.2: v48.65,7.75 48.65,8.99 52.28,12.61 54.15,12.61 54.97,13.44 54.97,17.28 54.31,17.94 53.35,17.94 51.48,19.82 40.3,19.82 v38.49,21.63
  Bottom 0.2: R16.1 49.17,7.23 v48.65,7.75 | v38.49,21.63 v38.5,21.63 41.66,24.79 43.14,24.79 45.6,27.25 45.6,34.02 46.06,34.48 46.06,37.59 45.81,37.84 42.01,37.84 41.81,37.65 41.81,37.61 40.89,36.69 35.38,36.69 34.67,35.98 SJ1.2
N$6
  Bottom 0.2: R25.1 34.1,28.72 35.14,29.76 Q3.3
N$7
  Bottom 0.2: R1.1 39.94,32.18 39.94,29.88 R30.2 38.74,30.7 Q3.2
N$8
  Bottom 0.61: L2.1 47.33,30.27 47.33,32.85 48.42,33.94 D14.C 48.9,36.54 D11.C
N$10
  Bottom 0.2: R1.2 31.9,38.21 Q2.4
  Bottom 0.254: Q2.4 30.59,36.9 24.41,36.9 Q2.2
N$12
  Bottom 0.2: R26.1 R29.1 37.01,26.97 35.78,28.2 Q3.1
N$14
  Bottom 0.2: Q1.B 23.14,23.98 R18.1
  Bottom 0.254: C14.2 R21.2 R18.1
N$15
  Bottom 0.2: Q2.1 26.03,32.97 R22.2 26.01,32.26 | C16.2 26.01,32.26 | R24.2 26.07,32.2 26.01,32.26
N$16
  Bottom 0.254: C18.1 26.5,14.2 U3.3
N$17
  Top 0.2: S8.3 26.5,5.2 26.5,7.95 25.3,9.15 D8.A
N$19
  Bottom 0.254: U2.1 16.77,36.5 C1.2
N$23
  Top 0.254: D7.A 29.9,10.95 27.7,13.15 S7.3
N$24
  Bottom 0.254: R5.2 18.67,32.1 17.82,32.95
  Bottom 0.305: U2.3 17.82,32.95 R2.1 C2.2
N$25
  Top 0.2: R6.1 7.65,33.63 LED2.A
N$28
  Top 0.254: D6.A 25.21,20.7 24.45,21.46 S6.3
N$29
  Top 0.2: S5.3 34.03,38.13 35.4,38.13 36.1,37.43 36.1,31.8 D5.A
N$30
  Top 0.2: D4.A 19.55,9.14 S4.3
N$31
  Top 0.2: D3.A 5.93,19.57 6.44,19.06 11.19,19.06 12.6,17.65 S3.3
N$32
  Top 0.2: D2.A 14,21.53 19.55,27.08 S2.3
N$33
  Top 0.2: LED3.A 7.55,23.53 R7.1
N$34
  Top 0.2: S1.3 19.55,36.94 13.77,31.16 D1.A
N$35
  Top 0.254: LED10.A R27.2
N$48
  Top 0.2: R8.1 3.77,18.21 LED4.A
N$50
  Top 0.2: R9.1 12.87,9.1 9.55,9.1 8,7.55 LED5.A
N$51
  Top 0.2: LED6.A 38.4,34.42 R10.1
N$53
  Top 0.254: R11.1 32.35,20.83 34.12,20.83 35.4,22.11 35.4,24.58 LED7.A
N$55
  Top 0.254: R12.1 39.55,15.4 LED8.A
N$57
  Top 0.2: R13.1 38.2,6.95 LED9.A
N$70
  Bottom 0.2: R25.2 31.76,29.15 29.41,29.15 28.38,30.18 D12.C 28.38,30.42 R24.1
PROG1  (via drill 0.35)
  Top 0.2: LED10.C 46.07,12.25 39.1,12.25 38.35,12.25 37.8,12.8 36.35,12.8 35.75,12.2 v35.75,11 | S9.3 49.95,7.05 47.85,7.05 47.44,7.46 47.44,10.89
  Top 0.254: 47.44,10.89 LED10.C
  Bottom 0.2: U1.2 33.94,11.01 v35.74,11.01 v35.75,11
PROG2  (via drill 0.35)
  Top 0.2: v33.58,20.01 33.9,20.01 35.91,22.02 35.91,28.24 34.99,29.16 34.99,30.35 35.26,30.62 39.66,30.62 | 39.66,30.62 41.45,32.41 S10.3 | LED11.C 44.77,27.06 43.22,27.06 39.66,30.62
  Bottom 0.2: U1.12 34.8,15.99 34.95,16.14 34.95,18.64 v33.58,20.01
PWM  (via drill 0.35)
  Top 0.2: v42.05,5.15 46.04,5.15 47.18,6.29 51.87,6.29 52.33,6.75 52.33,9.44 53.18,10.29 54.35,10.29 54.94,10.87 54.94,12.26 55.74,13.06 55.74,13.19 56.32,13.77 57.05,13.77 57.72,14.43 57.72,18.61 58.05,18.94 58.05,31.88 P1.3
  Bottom 0.2: v42.05,5.15 40.57,5.15 38,7.72 38,8.91 U1.43
REF
  Bottom 0.2: SJ1.3 33.19,35.16 33.19,33.12 D16.A 30.38,30.31 D12.A
RESET  (via drill 0.35)
  Top 0.2: v32.9,4.45 33.22,4.13 45.7,4.13 47.38,5.8 51.92,5.8 52.71,6.59 52.71,9.29 53.34,9.91 54.61,9.91 55.63,10.93 55.63,11.08 56.34,11.79 57.14,11.79 57.72,12.37 57.72,13.69 58.11,14.08 58.11,18.09 59.43,19.41 59.88,19.41 61.05,20.58 61.05,23.65 62.31,24.91 64.01,24.91 P2.10
  Bottom 0.2: C9.2 R15.1 | v32.9,4.45 31.6,5.75 C9.2 | U1.3 31.99,11.5 31.2,10.7 C9.2
RXD  (via drill 0.35)
  Top 0.2: P1.18 55.35,13.94 55.35,13.27 54.28,12.2 52.4,12.2 50.33,10.13 v50.33,9.39
  Bottom 0.2: v50.33,9.39 50.33,9.42 50.15,9.6 43.32,9.6 41.84,8.12 41.04,8.12 40.97,8.19 U1.37
SCL
  Bottom 0.2: U1.15 36.48,16.29 37.24,15.52 40.77,15.52 48.19,22.94 P1.12
SDA
  Bottom 0.2: U1.16 36.97,16.33 37.4,15.9 40.61,15.9 49.61,24.9 55.48,24.9 56.45,23.93 57.14,23.93 58.13,22.94 P1.11
SWCLK
  Bottom 0.2: U1.29 45.17,13.99 45.62,14.44 52.66,14.44 53.07,14.85 54.5,14.85 56.12,16.47 57.38,16.47 57.74,16.83 60.12,16.83 62.18,18.89 63.99,18.89 P2.4
SWDIO  (via drill 0.35)
  Top 0.2: v62.4,8.98 63.13,8.98 64.67,10.52 64.67,17.51 65,17.84 P2.2
  Bottom 0.2: U1.39 39.97,7.73 40.34,7.36 42.2,7.36 43.63,8.79 49.43,8.79 52.98,5.24 54.55,5.24 55.89,6.58 57.58,6.58 58.28,7.28 58.28,8.11 59.15,8.98 v62.4,8.98
TXD
  Bottom 0.2: P1.17 59.48,15.32 60.3,14.5 60.3,12.32 59.67,11.69 58.79,11.69 57.84,10.74 57.84,9.74 57.33,9.23 56.24,9.23 55.61,9.86 52.56,9.86 51.93,10.49 U1.36
XTALIN
  Bottom 0.254: C18.2 C22.1 30.94,12.99 U1.6

### Text on the board
Top: TOP
Bottom: BOT
tPlace: www.selfbus.org | LPC1115_4TE_TOP V2.0 beta
bNames: 1 | LPC1115_4TE_TOP V2.0 beta